# EAGLE design irisc (EAGLE 9.2.2)
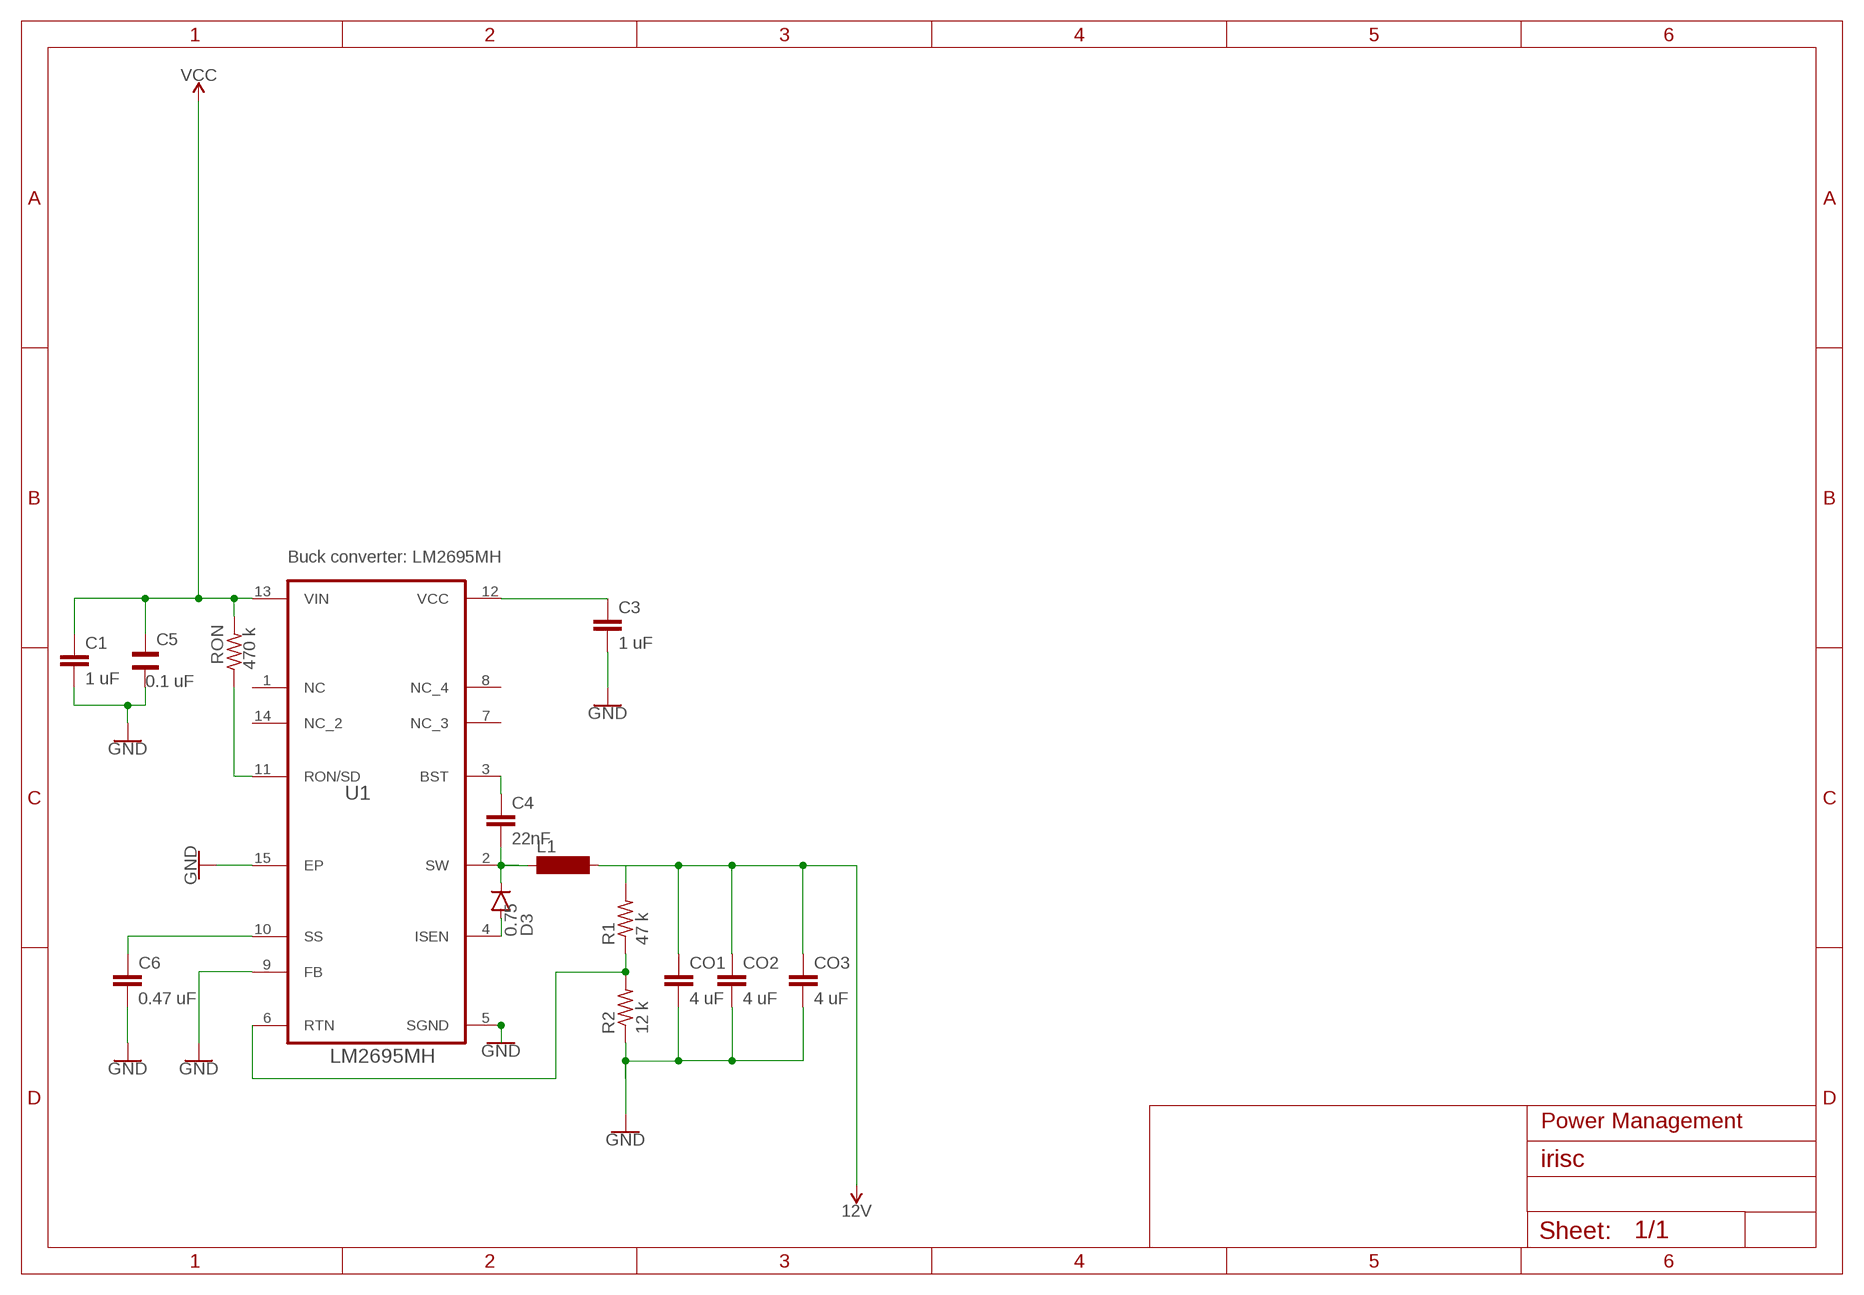
[diagram p0: schematic, sheet 1]

## Parts
C1  1 uF  CC1210  [C1210]
C3  1 uF  CC1210  [C1210]
C4  22nF  CC1206  [C1206]
C5  0.1 uF  WCAP-CSGP_0805_885012006082_REFLOW  [WCAP-CSGP_0805_REFLOW]
C6  0.47 uF  CC1210  [C1210]
CO1  4 uF  CC1812  [C1812]
CO2  4 uF  CC1812  [C1812]
CO3  4 uF  CC1812  [C1812]
D3  0.75  DIODE  [DIODE-1N4001-KIT]
L1  BS11  [BS11]
R1  47 k  FLIPFLOP-RES  [0805-THM]
R2  12 k  FLIPFLOP-RES  [0805-THM]
RON  470 k  FLIPFLOP-RES  [0805-THM]
U1  LM2695MH  [SOP65P640X110-15N]

## Nets
12V: CO1.1 CO2.1 CO3.1 L1.2 R1.2
GND: C1.2 C3.2 C5.1 C6.2 CO1.2 CO2.2 CO3.2 R2.1 U1.5(SGND) U1.9(FB) U1.15(EP)
N$123: R1.1 R2.2 U1.6(RTN)
N$124: C3.1 U1.12(VCC)
N$125: C4.1 U1.3(BST)
N$126: C4.2 D3.C L1.1 U1.2(SW)
N$127: RON.1 U1.11(RON/SD)
N$128: C6.1 U1.10(SS)
N$129: D3.A U1.4(ISEN)
VCC: C1.1 C5.2 RON.2 U1.13(VIN)
Unconnected: U1.1(NC) U1.7(NC_3) U1.8(NC_4) U1.14(NC_2)

## Notes on the sheet
- Buck converter: LM2695MH
- Power Management

## Library data of the parts
C1 C3 C4 C6 CO1-CO3 = eagle-ltspice:C: CAPACITOR, European symbol; SPICEMODEL: NONE; SPICEPREFIX: C
C5 = Wurth_Elektronik_Passive_Capacitors_rev18b:WCAP-CSGP_0805: WCAP-CSGP Ceramic Capacitors Characteristics Multilayer Ceramic Chip Capacitor Recommended soldering:Reflow, for 0603 and 0805 wave soldering is also allowed Operating temperature:-55 °C to +125 °C; Ceramic characteristics: Class I - NPO ; Class II -X7R, X5R High performance ceramic High capacitance stability Minimal aging Termination:Cu/Ni/Sn <http://katalog.we-online.de/media/images/eisos/WCAP-CSGP_pf2.jpg> Details see: http://katalog.we-online.de/en/pbs/WCAP-CSGP-0805? Created: 2015-01-28 2015 (C) Wurth Elektronik; SPICEPREFIX: C
D3 = BeagleBone_Blue_R3:DIODE: Diode These are standard reverse protection diodes and small signal diodes. SMA package can handle up to about 1A. SOD-323 can handle about 200mA. What the SOD-323 package when ordering, there are some mfgs out there that are 5-pin packages.; SPICEPREFIX: D
L1 = inductor-neosid:BS: INDUCTOR nominal inductance, magnetically screened; OC_FARNELL: unknown; OC_NEWARK: unknown
R1 R2 RON = adafruit:FLIPFLOP-RES: Flip Flop resistor An 0805 resistor inside a standard 1/4W 5% resistor. Makes for easy mods; SPICEPREFIX: R
U1 = LM2695MH:LM2695MH: IC BUCK ADJ 1.25A; DESCRIPTION: High Voltage _30V, 1.25A_ Step Down Switching Regulator 14-HTSSOP -40 to 125; DIGI-KEY_PART_NUMBER: LM2695MH/NOPB-ND; DIGI-KEY_PURCHASE_URL: https://www.digikey.se/product-detail/en/texas-instruments/LM2695MH-NOPB/LM2695MH-NOPB-ND/973743?utm_source=snapeda&utm_medium=aggregator&utm_campaign=symbol; MF: Texas Instruments; MP: LM2695MH/NOPB; PACKAGE: HTSSOP-14 Texas Instruments

## Board
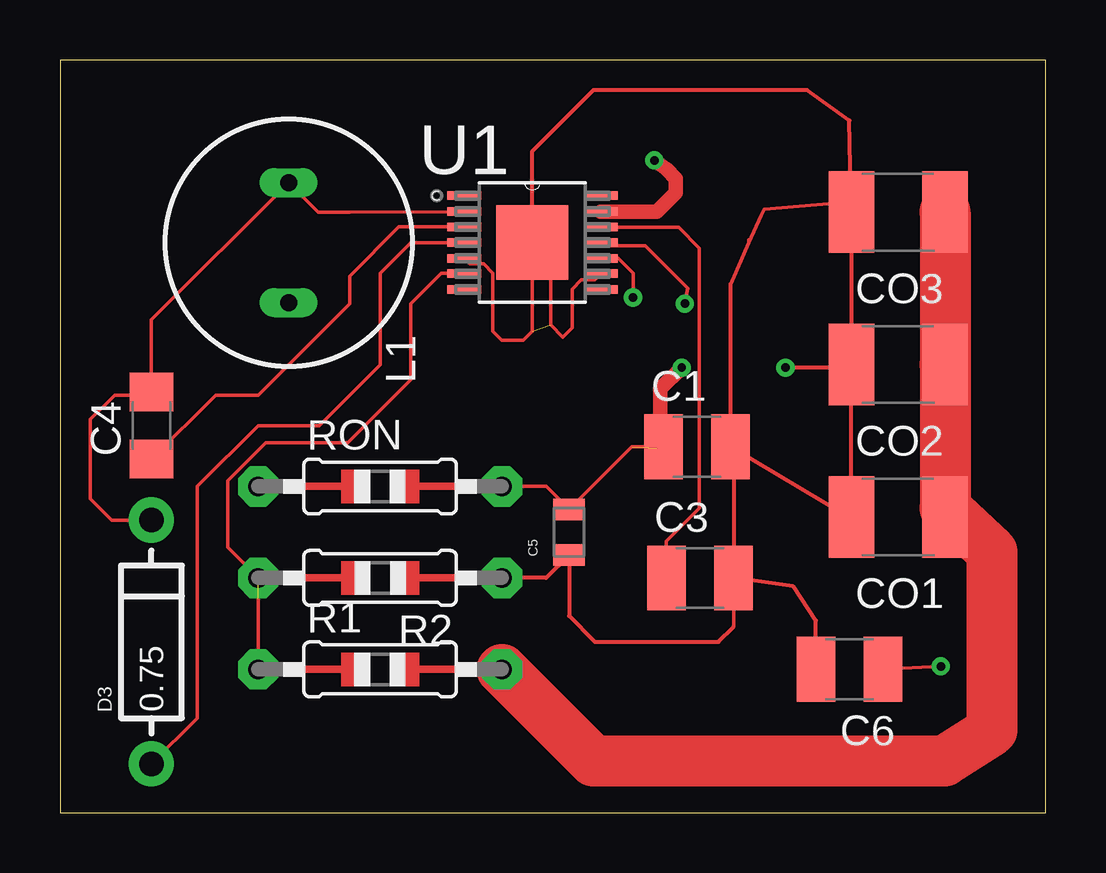
[diagram p1: board, top side]
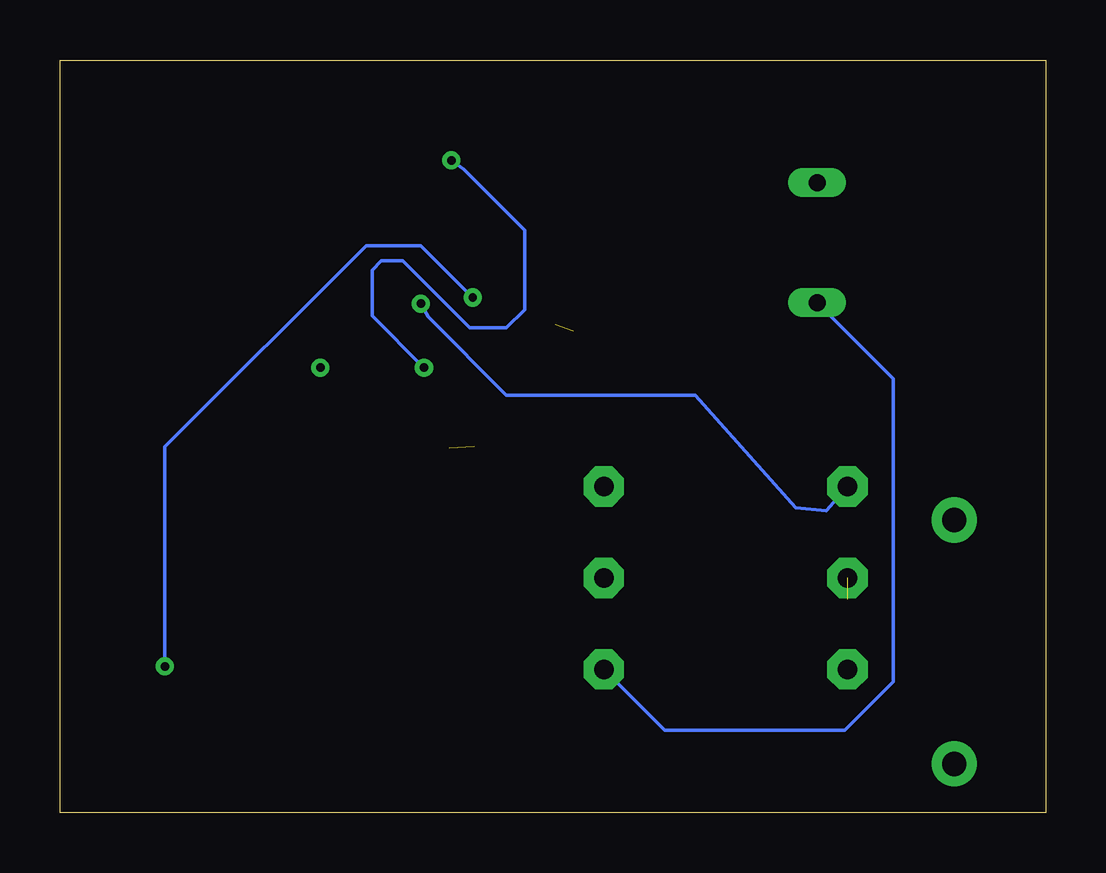
[diagram p2: board, bottom side, seen from below]

Size 41.07 x 31.36 mm. Coordinates in mm from the lower left corner, seen from the top.
Outline: 0,0 41.07,0 41.07,31.36 0,31.36 0,0
Copper layers (1*16): Top 0.035mm / dielectric 1.5mm / Bottom 0.035mm
Design rules "default": minimum track width 6mil, minimum drill 0.35mm, track to track 6mil, track to pad 6mil, pad to pad 6mil, via to via 6mil, smd to smd 6mil, copper to edge 40mil, drill to drill 6mil, minimum pad ring 10mil, minimum via ring 8mil, stop-mask expansion 4mil, vias tented up to drill 0mil, thermal gap 10mil

### Footprints (pad centres in the part's own frame; a part is rotated, then mirrored left to right if it is on the bottom)
C1210 = smd 1.6 x 2.7: 1 -1.4,0; 2 1.4,0
C1206 = smd 1.6 x 1.8: 1 -1.4,0; 2 1.4,0
WCAP-CSGP_0805_REFLOW = smd 0.9 x 1.3: 1 -0.95,0; 2 0.95,0
C1812 = smd 1.9 x 3.4: 1 -1.95,0; 2 1.95,0
DIODE-1N4001-KIT = drill 1.016 pad 1.88: A -5.08,0; C 5.08,0
BS11 = drill 0.7 long: 1 -2.5,0; 2 2.5,0
0805-THM = drill 0.813 pad 1.676 octagon: 1 -5.08,0; 2 5.08,0
SOP65P640X110-15N = smd 1.422 x 0.356: 1 -2.845,1.956; 2 -2.845,1.295; 3 -2.845,0.66; 4 -2.845,0; 5 -2.845,-0.66; 6 -2.845,-1.295; 7 -2.845,-1.956; 8 2.845,-1.956; 9 2.845,-1.295; 10 2.845,-0.66; 11 2.845,0; 12 2.845,0.66; 13 2.845,1.295; 14 2.845,1.956 | smd 2.997 x 3.099: 15 0,0

### Placement (x,y rotation side)
C1  26.54,15.24 0 top
C3  26.67,9.78 0 top
C4  3.81,16.13 90 top
C5  21.21,11.68 90 top
C6  32.89,5.97 180 top
CO1  34.92,12.32 180 top
CO2  34.92,18.67 180 top
CO3  34.92,25.02 180 top
D3  3.81,7.11 90 top
L1  9.53,23.75 270 top
R1  13.34,5.97 0 top
R2  13.34,9.78 180 top
RON  13.34,13.59 0 top
U1  19.68,23.75 0 top

### Tracks (layer width: path | path; a pad name or v marks a point on that pad's centre or on a via)
12V
  Top 0.152: 36.88,12.7 CO1.1 | R1.2 19.3,5.08
  Top 2.13: CO3.1 CO2.1 36.88,12.7 38.84,10.86 38.84,3.43 36.85,2.16 22.23,2.16 R1.2
  Bottom 0.152: R1.2 15.88,3.43 8.38,3.43 6.35,5.46 6.35,18.07 L1.2
GND  (via drill 0.35)  (1 unrouted)
  Top 0.152: 28.7,23.75 28.7,23.88 | U1.5 17.07,22.86 17.65,22.86 18.03,22.47 18.03,20.07 18.41,19.68 19.3,19.68 19.68,20.07 U1.15 | U1.9 22.28,22.2 21.72,22.2 21.34,21.81 21.34,20.19 20.95,19.81 20.45,20.32 20.45,23.37 | 28.07,7.75 C3.2 | 27.94,22.02 28.7,23.75 | 28.7,23.75 29.21,24.89 29.34,25.15 32.26,25.4 CO3.2 | CO2.2 32.98,18.54
  Top 0.17: R2.1 20.25,9.78 C5.1 21.21,8.19 22.29,7.11 27.43,7.11 28.07,7.75 | C1.2 27.94,22.02 | U1.15 19.68,27.56 22.23,30.1 31.11,30.1 32.89,28.83 CO3.2 CO2.2 CO1.2 32.85,12.32 C1.2 | C1.2 28.07,15.11 C3.2 30.55,9.43 31.5,8 C6.2 | 32.98,18.54 v30.23,18.54
N$123  (1 unrouted)
  Top 0.152: R1.1 8.26,8.89 | R2.2 6.99,11.05 6.99,13.83 8.57,15.42 11.99,15.42 14.61,18.03 14.61,21.21 15.88,22.48 16.82,22.48 U1.6
N$124
  Top 0.152: U1.12 22.55,24.38 25.78,24.38 26.64,23.52 26.64,12.67 25.27,11.3 C3.1
N$125
  Top 0.152: U1.3 14.12,24.41 12.06,22.35 12.06,21.21 8.26,17.4 6.48,17.4 C4.1
N$126
  Top 0.152: C4.2 3.81,20.53 L1.1 10.75,25.02 12.06,25.02 | C4.2 3.81,17.4 | U1.2 12.06,25.02 | 12.06,25.02 11.94,25.02 | C4.2 3.68,17.4 2.29,17.4 1.27,16.38 1.27,13.08 2.16,12.19 D3.C
N$127  (via drill 0.35)
  Top 0.152: U1.11 22.66,23.62 24.38,23.62 26.16,21.84 | 26.16,21.84 26.16,21.82 | 26.16,21.84 v26.04,21.21
  Bottom 0.152: v26.04,21.21 25.73,20.65 22.48,17.4 14.61,17.4 10.41,12.7 9.14,12.57 RON.1
N$128  (via drill 0.35)
  Top 0.152: 22.63,22.99 U1.10 23.27,23.09 23.88,22.48 v23.88,21.46 | C6.1 v36.7,6.1
  Bottom 0.152: v23.88,21.46 26.04,23.62 28.32,23.62 36.7,15.24 v36.7,6.1
N$129
  Top 0.152: U1.4 14.61,23.75 13.34,22.48 13.34,18.67 10.79,16.13 8.26,16.13 5.71,13.59 5.71,3.94 D3.A
VCC  (via drill 0.35)  (1 unrouted)
  Top 0.152: RON.2 20.25,13.59 C5.2 23.82,15.24 C1.1 25.02,15.36 | 25.27,26.8 25.26,26.81 | 24.86,15.17
  Top 0.601: U1.13 24.87,25.04 25.65,25.83 25.65,26.42 25.27,26.8 v24.77,27.18 | v25.91,18.54 25.02,17.65 25.02,15.36
  Bottom 0.152: v24.77,27.18 24.26,26.8 21.72,24.26 21.72,20.95 22.48,20.19 24,20.19 26.8,22.99 27.69,22.99 28.07,22.61 28.07,20.7 v25.91,18.54